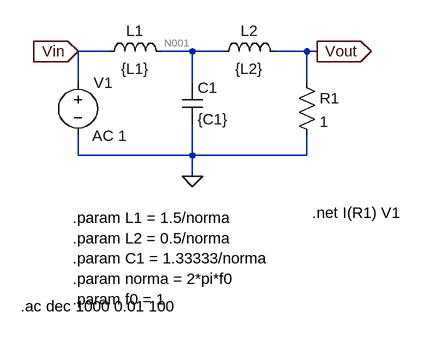
[diagram p0: schematic Ej 2asc.asc]
Ej 2asc.asc, the LTspice schematic file:
Version 4
SHEET 1 880 680
WIRE 96 80 48 80
WIRE 224 80 176 80
WIRE 272 80 224 80
WIRE 400 80 352 80
WIRE 416 80 400 80
WIRE 48 128 48 80
WIRE 224 128 224 80
WIRE 400 128 400 80
WIRE 48 240 48 208
WIRE 224 240 224 192
WIRE 224 240 48 240
WIRE 400 240 400 208
WIRE 400 240 224 240
WIRE 224 272 224 240
FLAG 224 272 0
FLAG 48 80 Vin
IOPIN 48 80 In
FLAG 416 80 Vout
IOPIN 416 80 Out
SYMBOL voltage 48 112 R0
WINDOW 123 22 98 Left 2
WINDOW 39 0 0 Left 0
SYMATTR Value2 AC 1
SYMATTR InstName V1
SYMATTR Value ""
SYMBOL ind 80 96 R270
WINDOW 0 32 56 VTop 2
WINDOW 3 5 56 VBottom 2
SYMATTR InstName L1
SYMATTR Value {L1}
SYMBOL ind 256 96 R270
WINDOW 0 32 56 VTop 2
WINDOW 3 5 56 VBottom 2
SYMATTR InstName L2
SYMATTR Value {L2}
SYMBOL cap 208 128 R0
SYMATTR InstName C1
SYMATTR Value {C1}
SYMBOL res 384 112 R0
SYMATTR InstName R1
SYMATTR Value 1
TEXT 40 336 Left 2 !.param L1 = 1.5/norma\n.param L2 = 0.5/norma\n.param C1 = 1.33333/norma\n.param norma = 2*pi*f0\n.param f0 = 1
TEXT -40 472 Left 2 !.ac dec 1000 0.01 100
TEXT 408 328 Left 2 !.net I(R1) V1

The netlist it stands for:
* Ej 2asc.asc
V1 Vin 0 AC 1
L1 Vin N001 {L1}
L2 N001 Vout {L2}
C1 N001 0 {C1}
R1 Vout 0 1
.param L1 = 1.5/norma
.param L2 = 0.5/norma
.param C1 = 1.33333/norma
.param norma = 2*pi*f0
.param f0 = 1
.ac dec 1000 0.01 100
.net I(R1) V1
.backanno
.end

* Results of the author's LTspice run, read from the files saved beside the schematic
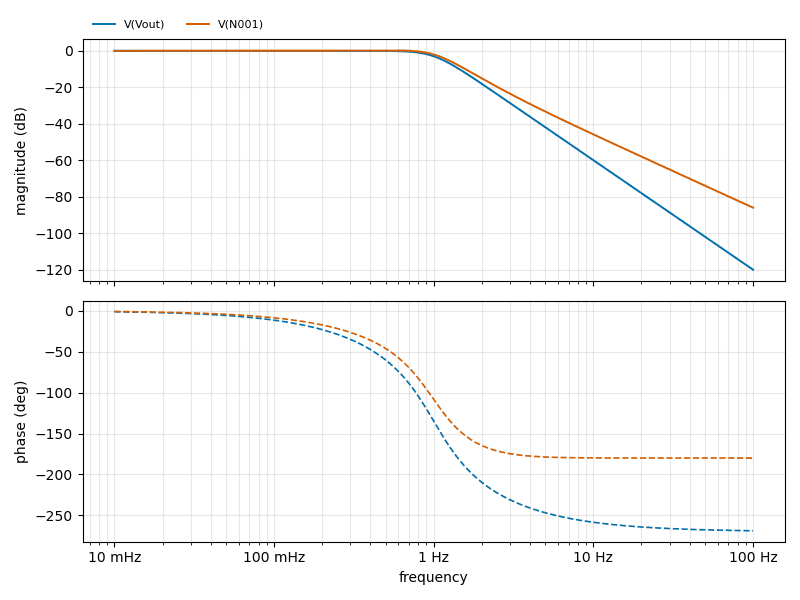
[diagram p1: AC Analysis of Ej 2asc.asc, plotted from the saved traces]
* AC Analysis, 1 run:
*   V(Vout): -0.02 dB at 10 mHz, -120.00 dB at 100 Hz, peak -0.02 dB at 221.3 mHz, 3 dB below the peak at 1.001 Hz
*   V(N001): -0.01 dB at 10 mHz, -86.02 dB at 100 Hz, peak 0.20 dB at 533.3 mHz, 3 dB below the peak at 1.064 Hz